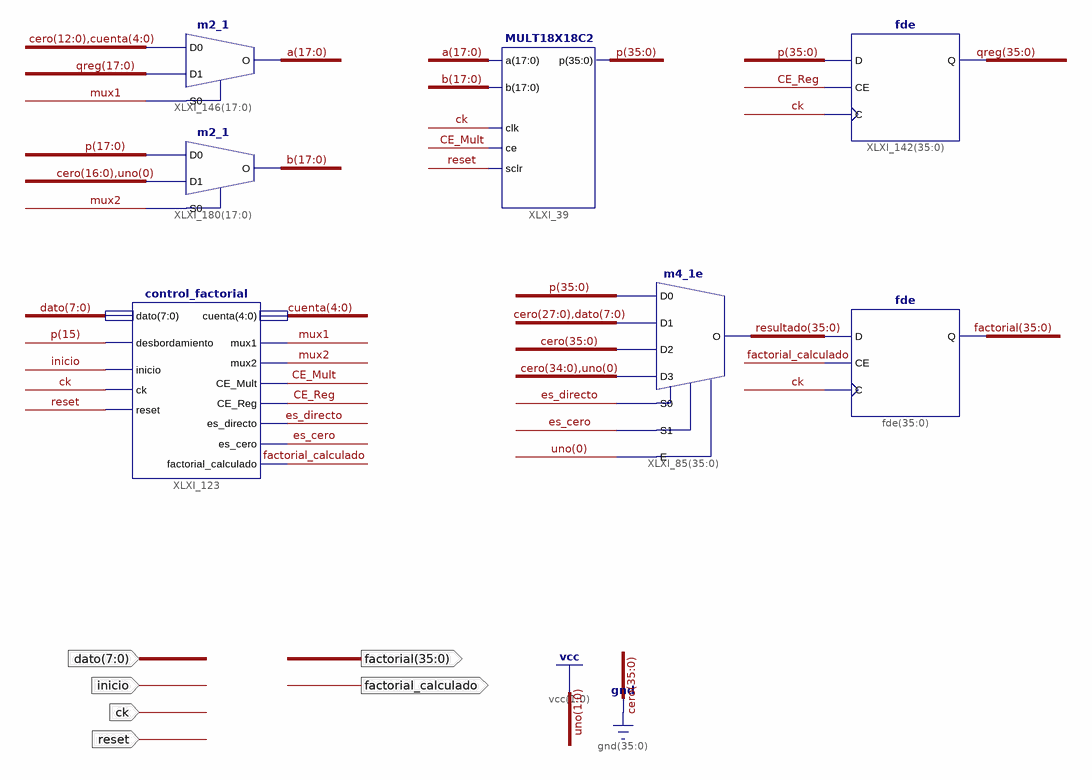
[diagram p0: schematic sheet 1]
// Xilinx ISE schematic Calculo_factorial.sch (spartan6) as structural Verilog: 7 symbols, 6 ports
module Calculo_factorial (
  input  [7:0] dato,
  input  ck,
  input  reset,
  input  inicio,
  output factorial_calculado,
  output [35:0] factorial
);

  wire CE_Mult, CE_Reg, es_cero, es_directo, mux1, mux2;
  wire [4:0] cuenta;
  wire [17:0] a, b;
  wire [35:0] p, qreg, resultado;

  MULT18X18C2 XLXI_39 (.a(a), .p(p), .b(b), .clk(ck), .sclr(reset), .ce(CE_Mult));
  m2_1 XLXI_146[17:0] (.D0({{13{1'b0}}, cuenta}), .D1(qreg[17:0]), .S0(mux1), .O(a));
  m2_1 XLXI_180[17:0] (.D0(p[17:0]), .D1(18'b000000000000000001), .S0(mux2), .O(b));
  fde XLXI_142[35:0] (.C(ck), .CE(CE_Reg), .D(p), .Q(qreg));
  control_factorial XLXI_123 (
    .ck(ck), .reset(reset), .inicio(inicio), .dato(dato), .factorial_calculado(factorial_calculado),
    .CE_Mult(CE_Mult), .es_directo(es_directo), .es_cero(es_cero), .mux1(mux1), .mux2(mux2), .CE_Reg(CE_Reg),
    .cuenta(cuenta), .desbordamiento(p[15]));
  fde fde[35:0] (.C(ck), .CE(factorial_calculado), .D(resultado), .Q(factorial));
  m4_1e XLXI_85[35:0] (
    .D0(p), .D1({{28{1'b0}}, dato}), .D2({36{1'b0}}), .D3(36'b000000000000000000000000000000000001),
    .E(1'b1), .S0(es_directo), .S1(es_cero), .O(resultado));
endmodule
